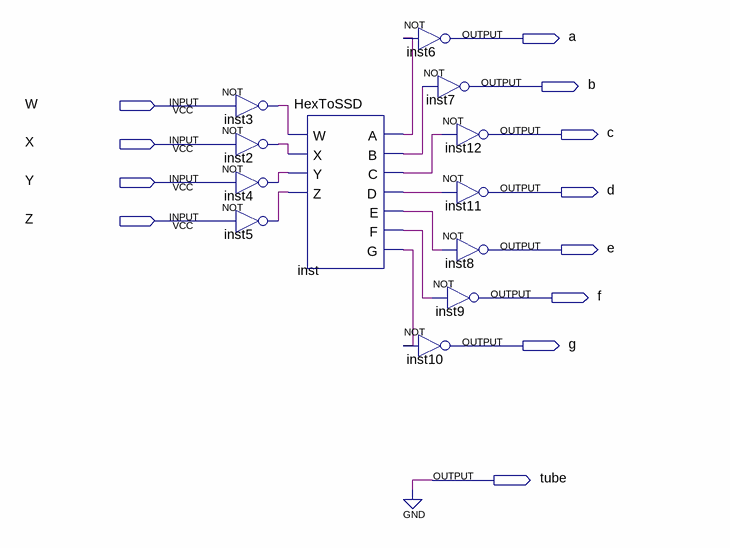
[diagram p0: schematic sheet]
// Quartus schematic HexToSSDTopLevel.bdf as structural Verilog: 12 symbols, 12 pins
module HexToSSDTopLevel (
  input  W,
  input  X,
  input  Y,
  input  Z,
  output a,
  output b,
  output c,
  output d,
  output e,
  output f,
  output g,
  output tube
);

  wire inst2_out, inst3_out, inst4_out, inst5_out, inst_a, inst_b, inst_c, inst_d, inst_e, inst_f, inst_g;

  not inst3 (inst3_out, W);
  not inst2 (inst2_out, X);
  not inst4 (inst4_out, Y);
  not inst5 (inst5_out, Z);
  HexToSSD inst (
    .W(inst3_out), .X(inst2_out), .Y(inst4_out), .Z(inst5_out), .A(inst_a), .B(inst_b), .C(inst_c),
    .D(inst_d), .E(inst_e), .F(inst_f), .G(inst_g));
  not inst6 (a, inst_a);
  not inst10 (g, inst_g);
  not inst7 (b, inst_b);
  not inst12 (c, inst_c);
  not inst11 (d, inst_d);
  not inst8 (e, inst_e);
  not inst9 (f, inst_f);

  assign tube = 1'b0;
endmodule
